# EAGLE design input-selector (EAGLE 7.7.0)

## Sheet 1 of 2
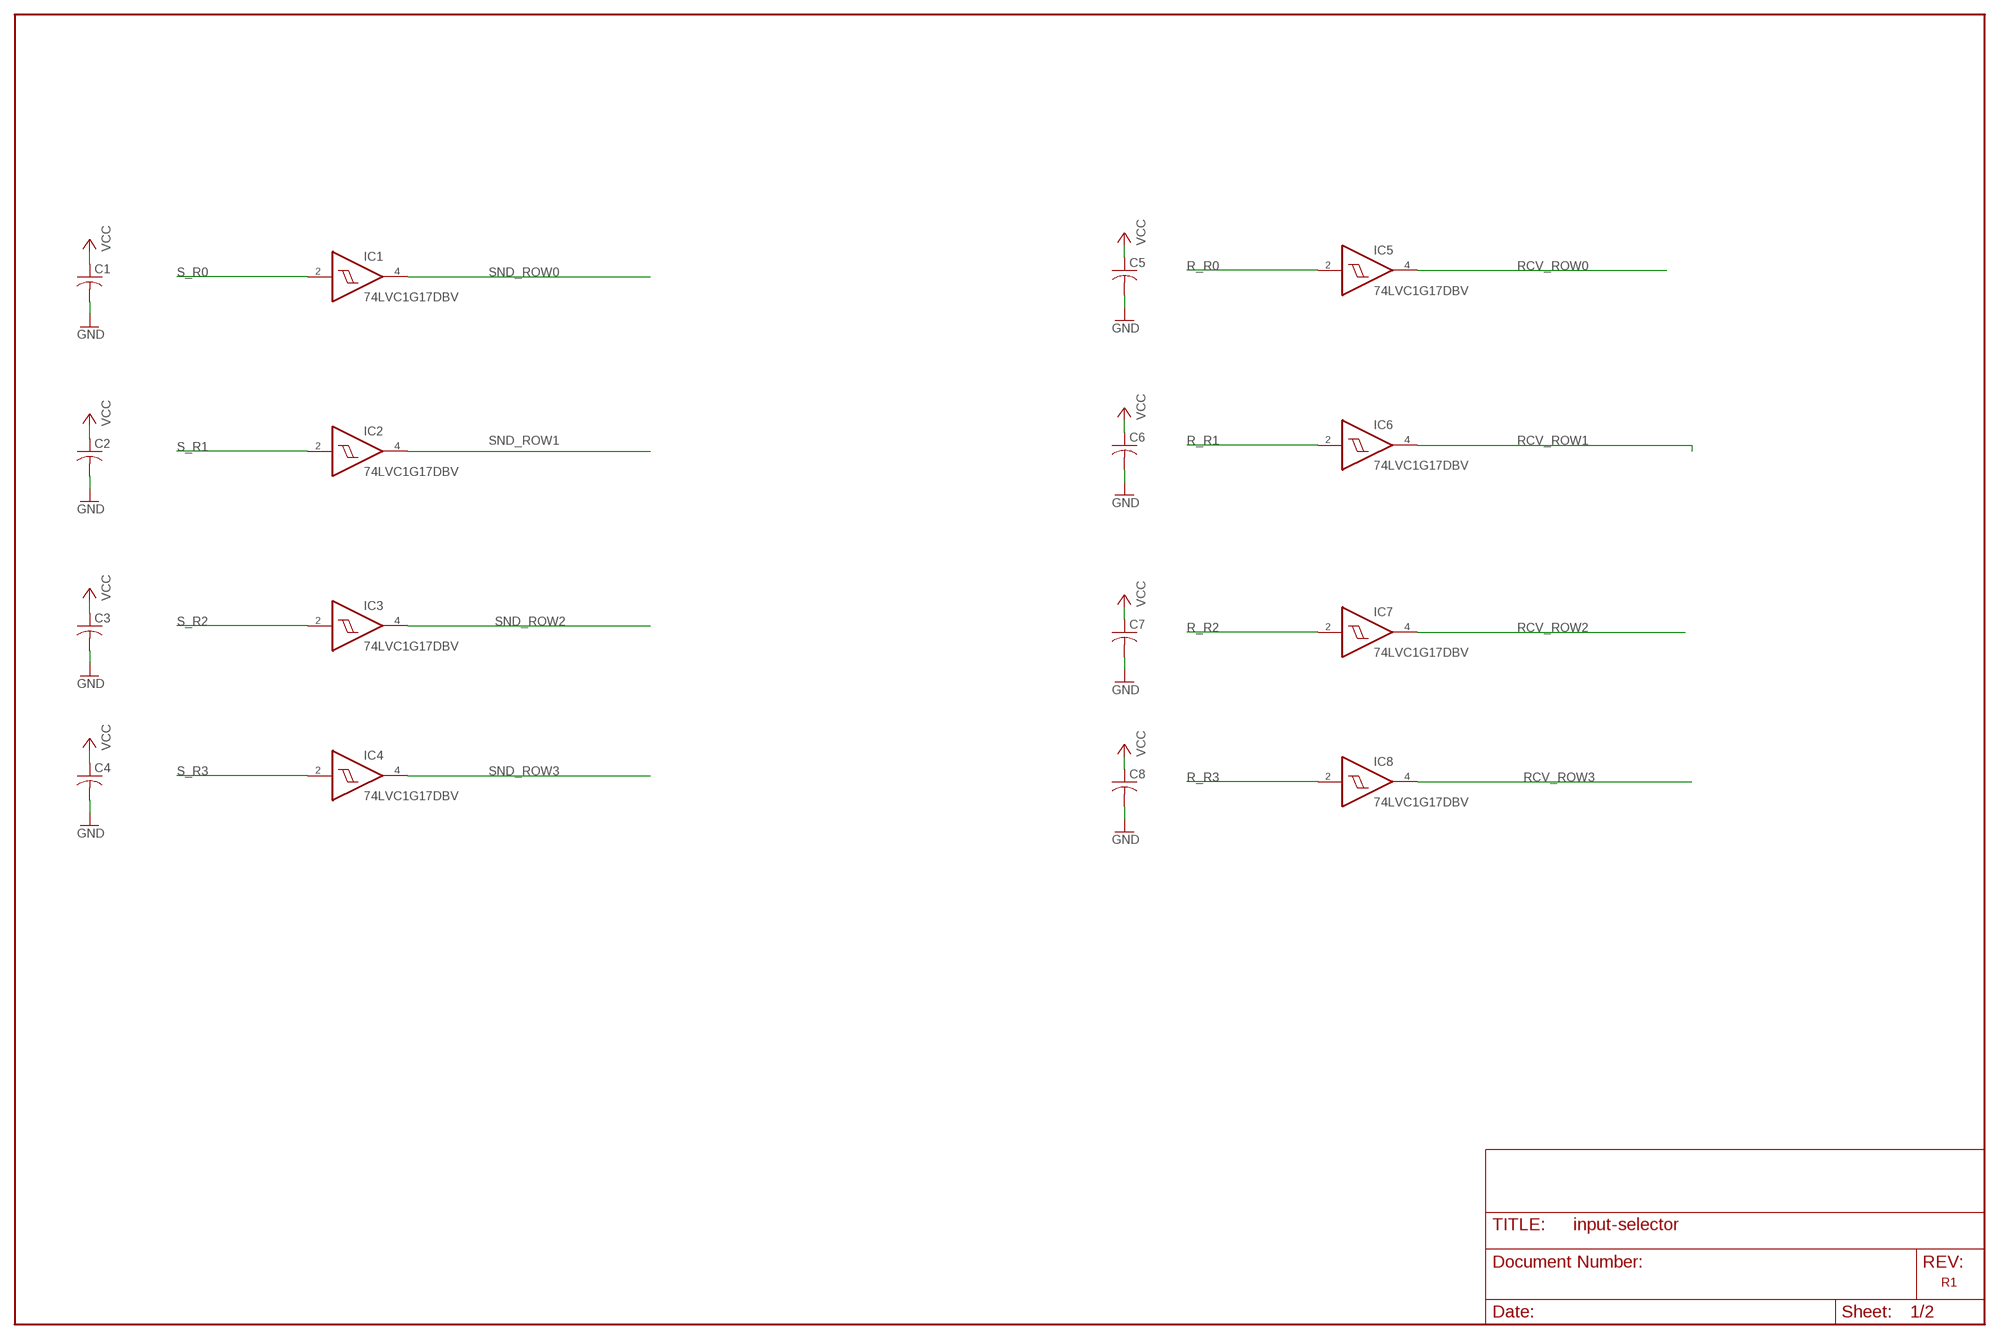
[diagram p0: schematic, sheet 1]

### Parts
C1  C-USC0603  [C0603]
C2  C-USC0603  [C0603]
C3  C-USC0603  [C0603]
C4  C-USC0603  [C0603]
C5  C-USC0603  [C0603]
C6  C-USC0603  [C0603]
C7  C-USC0603  [C0603]
C8  C-USC0603  [C0603]
IC1  74LVC1G17DBV  [SOT23-5]
IC2  74LVC1G17DBV  [SOT23-5]
IC3  74LVC1G17DBV  [SOT23-5]
IC4  74LVC1G17DBV  [SOT23-5]
IC5  74LVC1G17DBV  [SOT23-5]
IC6  74LVC1G17DBV  [SOT23-5]
IC7  74LVC1G17DBV  [SOT23-5]
IC8  74LVC1G17DBV  [SOT23-5]

### Nets
GND: C1.2 C2.2 C3.2 C4.2 C5.2 C6.2 C7.2 C8.2 ; also sheet 2
R_R0: IC5.2(I) ; also sheet 2
R_R1: IC6.2(I) ; also sheet 2
R_R2: IC7.2(I) ; also sheet 2
R_R3: IC8.2(I) ; also sheet 2
RCV_ROW0: IC5.4(O) ; also sheet 2
RCV_ROW1: IC6.4(O) ; also sheet 2
RCV_ROW2: IC7.4(O) ; also sheet 2
RCV_ROW3: IC8.4(O) ; also sheet 2
S_R0: IC1.2(I) ; also sheet 2
S_R1: IC2.2(I) ; also sheet 2
S_R2: IC3.2(I) ; also sheet 2
S_R3: IC4.2(I) ; also sheet 2
SND_ROW0: IC1.4(O) ; also sheet 2
SND_ROW1: IC2.4(O) ; also sheet 2
SND_ROW2: IC3.4(O) ; also sheet 2
SND_ROW3: IC4.4(O) ; also sheet 2
VCC: C1.1 C2.1 C3.1 C4.1 C5.1 C6.1 C7.1 C8.1 ; also sheet 2

### Notes on the sheet
- R1

## Sheet 2 of 2
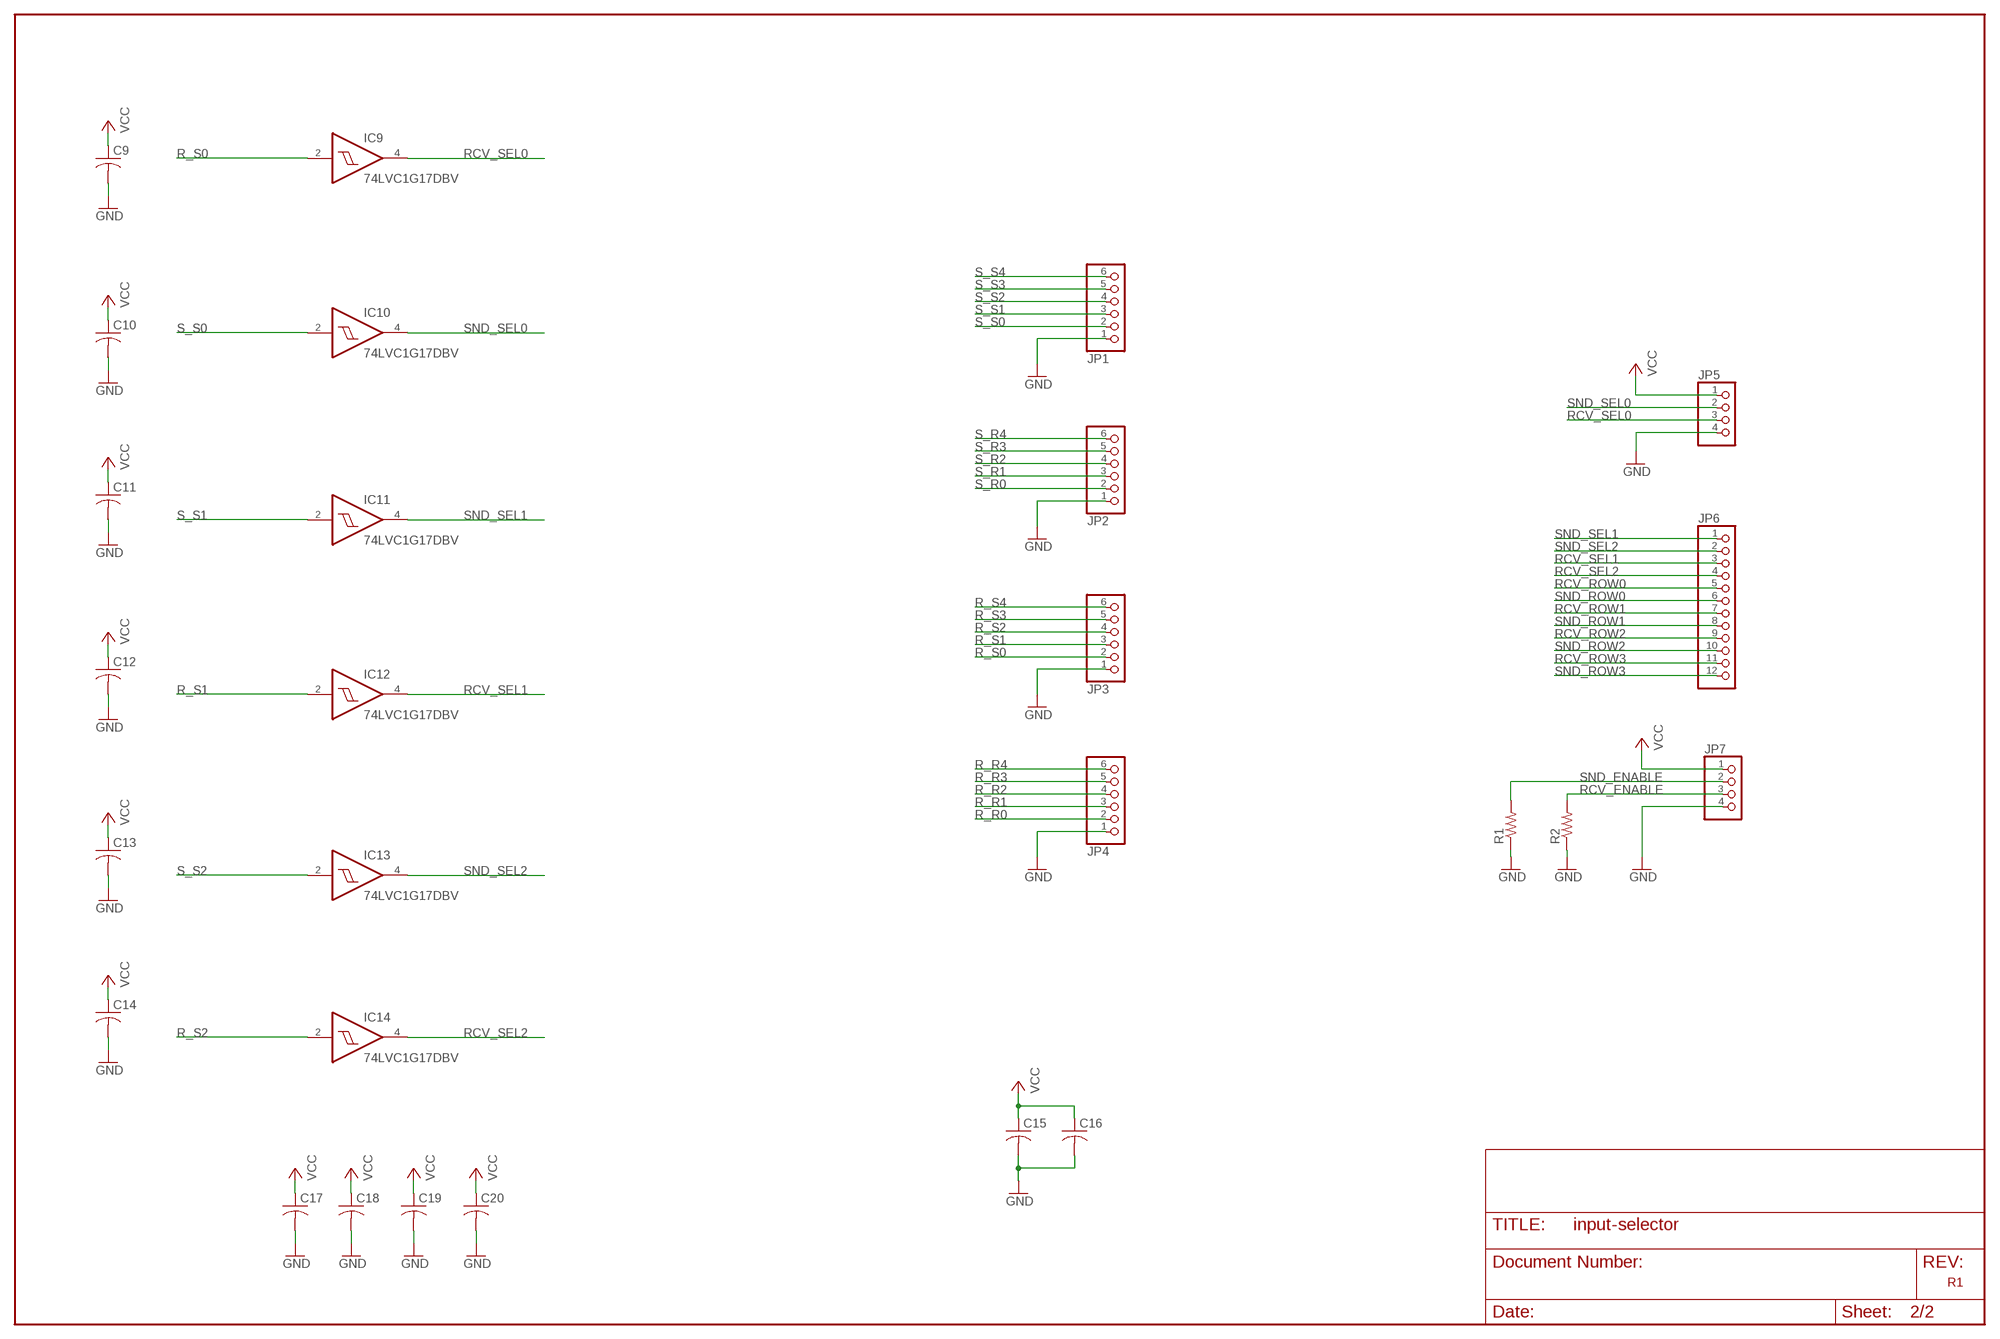
[diagram p1: schematic, sheet 2]

### Parts
C9  C-USC0603  [C0603]
C10  C-USC0603  [C0603]
C11  C-USC0603  [C0603]
C12  C-USC0603  [C0603]
C13  C-USC0603  [C0603]
C14  C-USC0603  [C0603]
C15  C-USC0805  [C0805]
C16  C-USC0805  [C0805]
C17  C-USC0603  [C0603]
C18  C-USC0603  [C0603]
C19  C-USC0603  [C0603]
C20  C-USC0603  [C0603]
IC9  74LVC1G17DBV  [SOT23-5]
IC10  74LVC1G17DBV  [SOT23-5]
IC11  74LVC1G17DBV  [SOT23-5]
IC12  74LVC1G17DBV  [SOT23-5]
IC13  74LVC1G17DBV  [SOT23-5]
IC14  74LVC1G17DBV  [SOT23-5]
JP1  PINHD-1X6  [1X06]
JP2  PINHD-1X6  [1X06]
JP3  PINHD-1X6  [1X06]
JP4  PINHD-1X6  [1X06]
JP5  PINHD-1X4  [1X04]
JP6  PINHD-1X12  [1X12]
JP7  PINHD-1X4  [1X04]
R1  R-US_R0805  [R0805]
R2  R-US_R0805  [R0805]

### Nets
GND: C9.2 C10.2 C11.2 C12.2 C13.2 C14.2 C15.2 C16.2 C17.2 C18.2 C19.2 C20.2 JP1.1 JP2.1 JP3.1 JP4.1 JP5.4 JP7.4 R1.1 R2.1 ; also sheet 1
R_R0: JP4.2 ; also sheet 1
R_R1: JP4.3 ; also sheet 1
R_R2: JP4.4 ; also sheet 1
R_R3: JP4.5 ; also sheet 1
R_R4: JP4.6
R_S0: IC9.2(I) JP3.2
R_S1: IC12.2(I) JP3.3
R_S2: IC14.2(I) JP3.4
R_S3: JP3.5
R_S4: JP3.6
RCV_ENABLE: JP7.3 R2.2
RCV_ROW0: JP6.5 ; also sheet 1
RCV_ROW1: JP6.7 ; also sheet 1
RCV_ROW2: JP6.9 ; also sheet 1
RCV_ROW3: JP6.11 ; also sheet 1
RCV_SEL0: IC9.4(O) JP5.3
RCV_SEL1: IC12.4(O) JP6.3
RCV_SEL2: IC14.4(O) JP6.4
S_R0: JP2.2 ; also sheet 1
S_R1: JP2.3 ; also sheet 1
S_R2: JP2.4 ; also sheet 1
S_R3: JP2.5 ; also sheet 1
S_R4: JP2.6
S_S0: IC10.2(I) JP1.2
S_S1: IC11.2(I) JP1.3
S_S2: IC13.2(I) JP1.4
S_S3: JP1.5
S_S4: JP1.6
SND_ENABLE: JP7.2 R1.2
SND_ROW0: JP6.6 ; also sheet 1
SND_ROW1: JP6.8 ; also sheet 1
SND_ROW2: JP6.10 ; also sheet 1
SND_ROW3: JP6.12 ; also sheet 1
SND_SEL0: IC10.4(O) JP5.2
SND_SEL1: IC11.4(O) JP6.1
SND_SEL2: IC13.4(O) JP6.2
VCC: C9.1 C10.1 C11.1 C12.1 C13.1 C14.1 C15.1 C16.1 C17.1 C18.1 C19.1 C20.1 JP5.1 JP7.1 ; also sheet 1

### Notes on the sheet
- R1

## Power pins joined to a net without a drawn wire
GND: IC1.3(GND) IC2.3(GND) IC3.3(GND) IC4.3(GND) IC5.3(GND) IC6.3(GND) IC7.3(GND) IC8.3(GND) IC9.3(GND) IC10.3(GND) IC11.3(GND) IC12.3(GND) IC13.3(GND) IC14.3(GND)
VCC: IC1.5(VCC) IC2.5(VCC) IC3.5(VCC) IC4.5(VCC) IC5.5(VCC) IC6.5(VCC) IC7.5(VCC) IC8.5(VCC) IC9.5(VCC) IC10.5(VCC) IC11.5(VCC) IC12.5(VCC) IC13.5(VCC) IC14.5(VCC)

## Library data of the parts
C1-C20 = resistor:C-US: CAPACITOR, American symbol
IC1-IC14 = 74xx-little-us:74*1G17: Single Schmitt-Trigger Buffer
JP1-JP4 = custom-pinhead:PINHD-1X6: PIN HEADER
JP5 JP7 = pinhead:PINHD-1X4: PIN HEADER
JP6 = custom-pinhead:PINHD-1X12: PIN HEADER
R1 R2 = resistor:R-US_: RESISTOR, American symbol

## Board
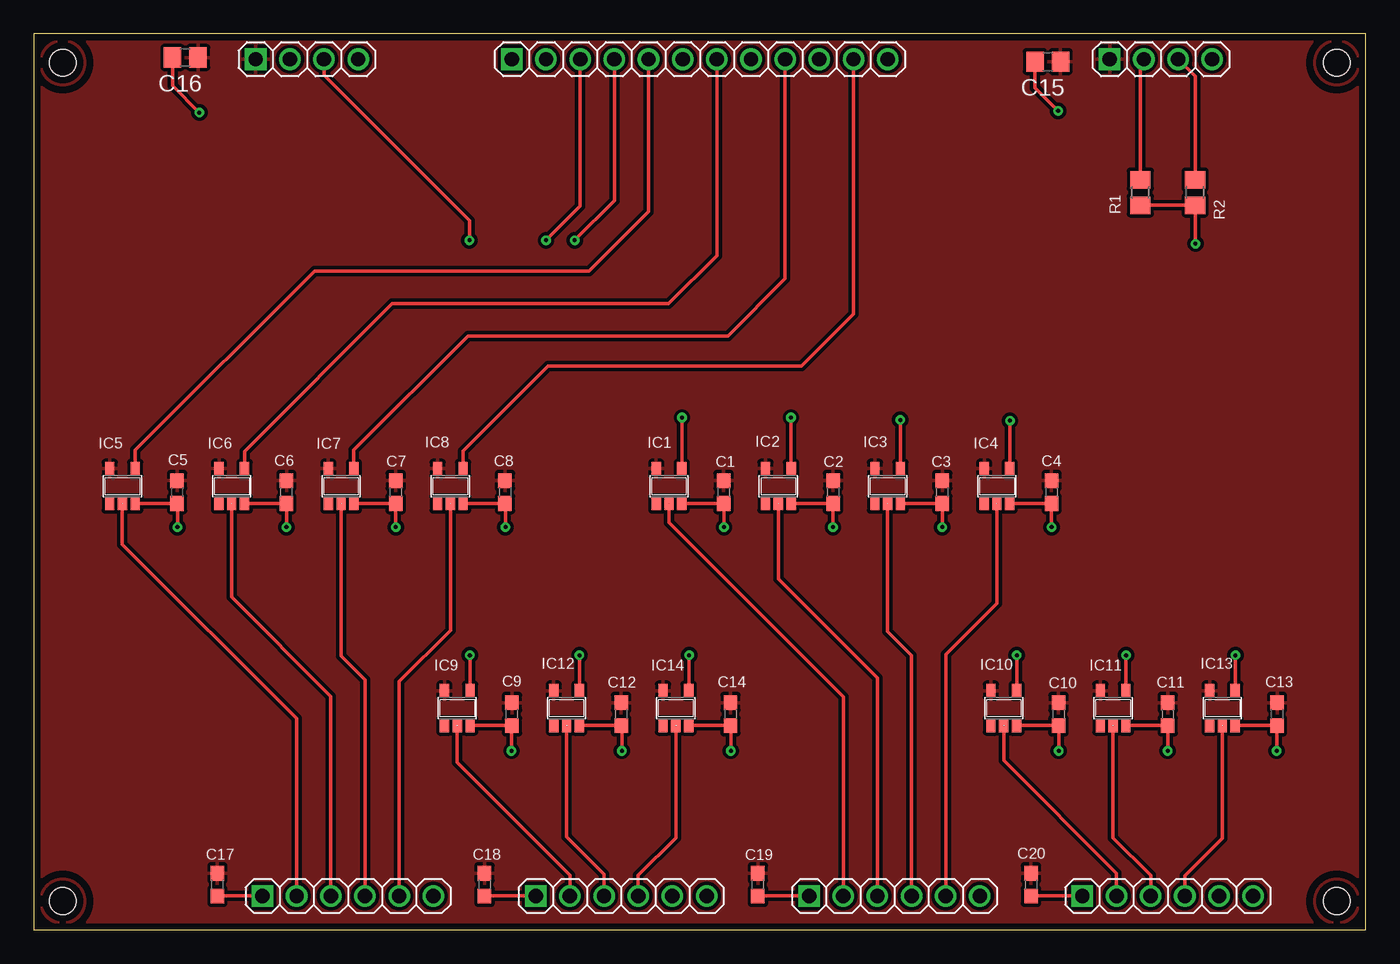
[diagram p2: board, top side]
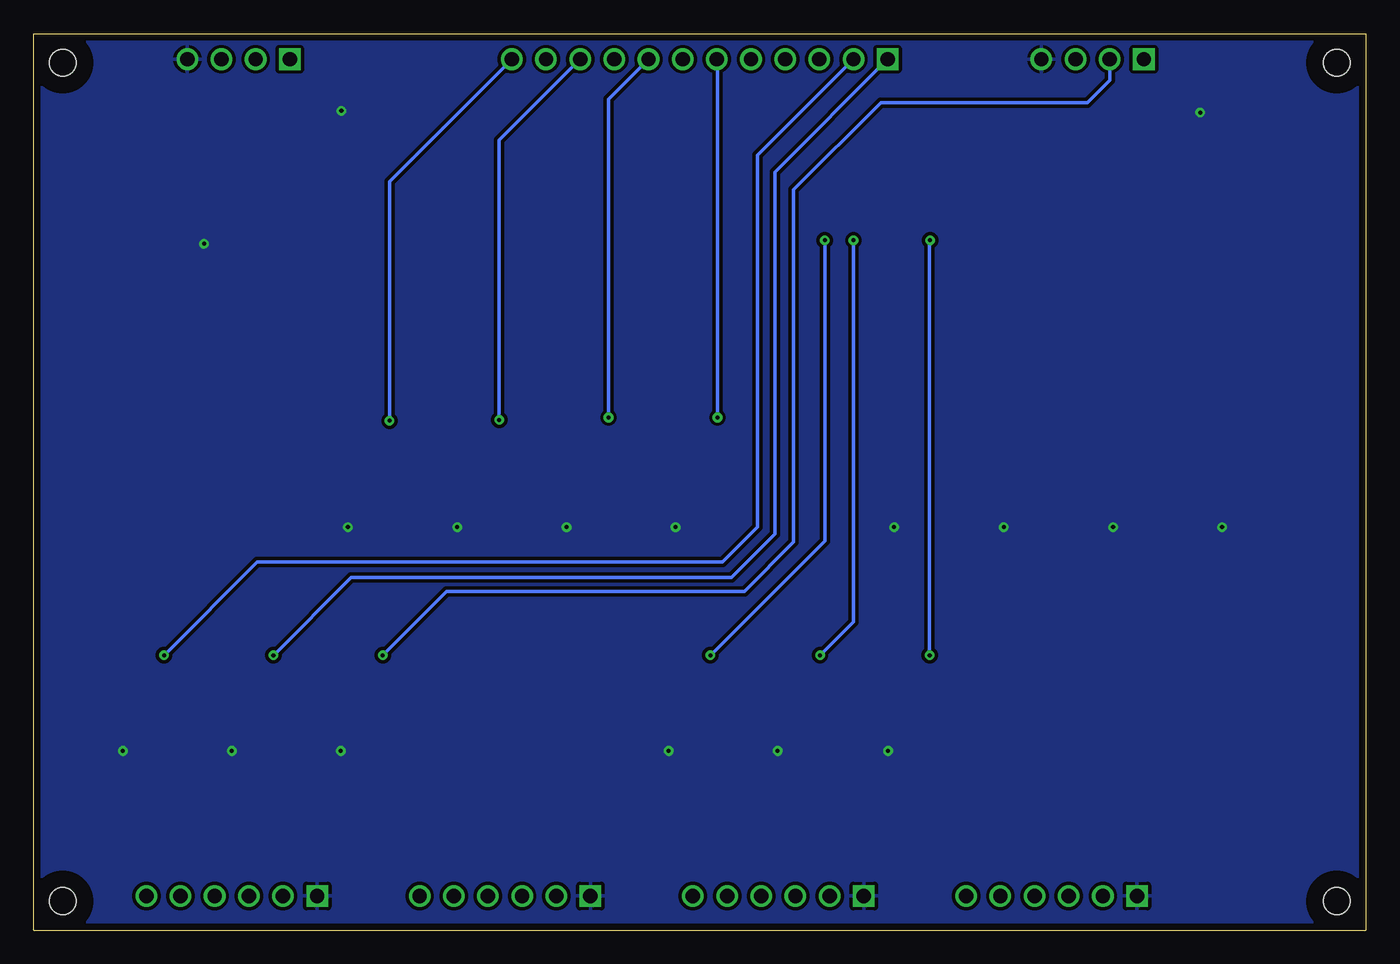
[diagram p3: board, bottom side, seen from below]

Size 99.06 x 66.67 mm. Coordinates in mm from the lower left corner, seen from the top.
Outline: 99.06,66.67 0,66.67 0,0 99.06,0 99.06,66.67
Copper layers (1*16): Top 0.035mm / dielectric 1.5mm / Bottom 0.035mm
Design rules "default *": minimum track width 8mil, minimum drill 12mil, track to track 8mil, track to pad 10mil, pad to pad 10mil, via to via 8mil, smd to smd 8mil, copper to edge 20mil, drill to drill 8mil, minimum pad ring 10mil, minimum via ring 8mil, stop-mask expansion 4mil, vias tented up to drill 0mil, thermal gap 10mil
Holes 2.01 mm at 2.16,2.16 96.9,2.16 96.9,64.52 2.16,64.52
tRestrict: area 94.9,0.2 to 98.9,4.2; area 94.9,62.5 to 98.9,66.5; area 0.2,62.5 to 4.2,66.5; area 0.2,0.2 to 4.2,4.2
bRestrict: area 94.9,0.2 to 98.9,4.2; area 94.9,62.5 to 98.9,66.5; area 0.2,62.5 to 4.2,66.5; area 0.2,0.2 to 4.2,4.2

### Footprints (pad centres in the part's own frame; a part is rotated, then mirrored left to right if it is on the bottom)
C0603 = smd 1.1 x 1: 1 -0.85,0; 2 0.85,0
C0805 = smd 1.3 x 1.5: 1 -0.95,0; 2 0.95,0
SOT23-5 = smd 0.69 x 0.99: 1 -0.95,-1.29; 2 0,-1.29; 3 0.95,-1.29; 4 0.95,1.3; 5 -0.95,1.3
1X06 = drill 1.067 square: 1 -6.35,0 | drill 1.067: 2 -3.81,0; 3 -1.27,0; 4 1.27,0; 5 3.81,0; 6 6.35,0
1X04 = drill 1.067 square: 1 -3.81,0 | drill 1.067: 2 -1.27,0; 3 1.27,0; 4 3.81,0
1X12 = drill 1.067 square: 1 -13.97,0 | drill 1.067: 2 -11.43,0; 3 -8.89,0; 4 -6.35,0; 5 -3.81,0; 6 -1.27,0; 7 1.27,0; 8 3.81,0; 9 6.35,0; 10 8.89,0; 11 11.43,0; 12 13.97,0
R0805 = smd 1.3 x 1.5: 1 -0.95,0; 2 0.95,0

### Placement (x,y rotation side)
C1  51.31,32.58 270 top
C2  59.44,32.58 270 top
C3  67.56,32.58 270 top
C4  75.69,32.58 270 top
C5  10.67,32.58 270 top
C6  18.8,32.58 270 top
C7  26.92,32.58 270 top
C8  35.05,32.58 270 top
C9  35.56,16.07 270 top
C10  76.2,16.07 270 top
C11  84.33,16.07 270 top
C12  43.69,16.07 270 top
C13  92.46,16.07 270 top
C14  51.82,16.07 270 top
C15  75.41,64.59 180 top
C16  11.28,64.9 180 top
C17  13.67,3.39 270 top
C18  33.53,3.39 270 top
C19  53.85,3.39 270 top
C20  74.17,3.39 270 top
IC1  47.24,33.02 0 top
IC2  55.37,33.02 0 top
IC3  63.5,33.02 0 top
IC4  71.63,33.02 0 top
IC5  6.6,33.02 0 top
IC6  14.73,33.02 0 top
IC7  22.86,33.02 0 top
IC8  30.99,33.02 0 top
IC9  31.5,16.51 0 top
IC10  72.14,16.51 0 top
IC11  80.26,16.51 0 top
IC12  39.62,16.51 0 top
IC13  88.39,16.51 0 top
IC14  47.75,16.51 0 top
JP1  84.33,2.54 0 top
JP2  64.01,2.54 0 top
JP3  43.69,2.54 0 top
JP4  23.37,2.54 0 top
JP5  20.32,64.77 0 top
JP6  49.53,64.77 0 top
JP7  83.82,64.77 0 top
R1  82.3,54.86 90 top
R2  86.36,54.86 90 top

### Tracks (layer width: path | path; a pad name or v marks a point on that pad's centre or on a via)
GND  (via drill 0.3)
  Top 0.254: IC10.3 C10.2 76.22,15.19 v76.22,13.34 | IC11.3 C11.2 v84.33,13.34 | IC13.3 C13.2 92.43,15.19 v92.43,13.34 | IC9.3 C9.2 35.53,15.19 v35.53,13.34 | IC12.3 C12.2 43.74,15.16 v43.74,13.34 | IC14.3 C14.2 51.84,15.19 v51.84,13.34 | IC1.3 C1.2 51.33,31.7 v51.33,29.97 | IC2.3 C2.2 v59.44,29.97 | IC3.3 C3.2 v67.56,29.97 | IC4.3 C4.2 v75.69,29.97 | IC5.3 C5.2 10.69,31.7 v10.69,29.97 | IC6.3 C6.2 v18.8,29.97 | IC7.3 C7.2 v26.92,29.97 | IC8.3 C8.2 35.08,31.7 v35.08,29.97 | R1.1 R2.1 86.39,53.89 v86.39,51.05 | C16.2 10.33,62.8 v12.32,60.81 | C15.2 74.46,62.65 v76.17,60.94 | JP4.1 C17.2 | JP3.1 C18.2 | JP2.1 C19.2 | JP1.1 C20.2
  pour Bottom (isolate 0.254): 99.06,0 0,0 0,66.67 99.06,66.67
R_R0
  Top 0.254: IC5.2 6.6,28.7 19.56,15.75 JP4.2
R_R1
  Top 0.254: IC6.2 14.73,24.77 22.1,17.4 JP4.3
R_R2
  Top 0.254: IC7.2 22.86,20.4 24.64,18.62 JP4.4
R_R3
  Top 0.254: IC8.2 30.99,22.3 27.18,18.49 JP4.5
R_S0
  Top 0.254: IC9.2 31.5,12.47 39.88,4.09 JP3.2
R_S1
  Top 0.254: IC12.2 39.62,6.93 42.42,4.14 JP3.3
R_S2
  Top 0.254: IC14.2 47.75,6.88 44.96,4.09 JP3.4
RCV_ENABLE
  Top 0.254: R2.2 86.36,63.5 JP7.3
RCV_ROW0
  Top 0.254: IC5.4 7.55,35.7 20.88,49.02 41.3,49.02 45.72,53.44 JP6.5
RCV_ROW1
  Top 0.254: IC6.4 15.68,35.6 26.67,46.58 47.22,46.58 50.8,50.16 JP6.7
RCV_ROW2
  Top 0.254: IC7.4 23.81,35.7 32.31,44.2 51.64,44.2 55.88,48.44 JP6.9
RCV_ROW3
  Top 0.254: IC8.4 31.94,35.65 38.25,41.96 57.1,41.96 60.96,45.82 JP6.11
RCV_SEL0  (via drill 0.3)
  Top 0.254: JP5.3 21.59,63.58 32.41,52.76 v32.41,51.31 | v32.44,20.45 32.44,17.81 IC9.4
  Bottom 0.254: v32.41,51.31 32.44,51.26 v32.44,20.45
RCV_SEL1  (via drill 0.3)
  Top 0.254: v40.59,20.45 40.59,17.82 IC12.4 | JP6.3 40.64,53.85 v38.1,51.31
  Bottom 0.254: v38.1,51.31 38.1,22.94 v40.59,20.45
RCV_SEL2  (via drill 0.3)
  Top 0.254: v48.74,20.45 48.74,17.85 IC14.4 | JP6.4 43.18,54.25 v40.23,51.31
  Bottom 0.254: v40.23,51.31 40.23,28.96 v48.74,20.45
S_R0
  Top 0.254: IC1.2 47.24,30.3 60.2,17.35 JP2.2
S_R1
  Top 0.254: IC2.2 55.37,26.14 62.74,18.77 JP2.3
S_R2
  Top 0.254: IC3.2 63.5,22.23 65.28,20.45 JP2.4
S_R3
  Top 0.254: IC4.2 71.63,24.31 67.82,20.5 JP2.5
S_S0
  Top 0.254: IC10.2 72.14,12.62 80.52,4.24 JP1.2
S_S1
  Top 0.254: IC11.2 80.26,6.88 83.06,4.09 JP1.3
S_S2
  Top 0.254: IC13.2 88.39,6.83 85.6,4.04 JP1.4
SND_ENABLE
  Top 0.254: R1.2 82.3,64.52 JP7.2
SND_ROW0  (via drill 0.3)
  Top 0.254: v48.21,38.12 arc90 48.19,38.11 IC1.4
  Bottom 0.254: JP6.6 48.21,64.72 v48.21,38.12
SND_ROW1  (via drill 0.3)
  Top 0.254: v56.31,38.12 56.32,38.12 IC2.4
  Bottom 0.254: JP6.8 56.31,61.8 v56.31,38.12
SND_ROW2  (via drill 0.3)
  Top 0.254: v64.44,37.95 IC3.4
  Bottom 0.254: JP6.10 64.44,58.75 v64.44,37.95
SND_ROW3  (via drill 0.3)
  Top 0.254: v72.59,37.9 72.59,34.34 arc-90 IC4.4
  Bottom 0.254: JP6.12 72.59,55.68 v72.59,37.9
SND_SEL0  (via drill 0.3)
  Top 0.254: v73.1,20.45 73.1,17.82 IC10.4
  Bottom 0.254: JP5.2 19.05,63.2 20.7,61.54 36.07,61.54 42.55,55.07 42.55,28.85 46.2,25.2 68.35,25.2 v73.1,20.45
SND_SEL1  (via drill 0.3)
  Top 0.254: v81.23,20.45 81.23,17.82 IC11.4
  Bottom 0.254: JP6.1 43.94,56.39 43.94,29.46 47.17,26.24 75.44,26.24 v81.23,20.45
SND_SEL2  (via drill 0.3)
  Top 0.254: v89.36,20.45 89.36,17.82 IC13.4
  Bottom 0.254: JP6.2 45.24,57.63 45.24,29.97 47.83,27.38 82.42,27.38 v89.36,20.45
VCC
  pour Top (isolate 0.254, rank 2): 99.06,0 0,0 0,66.67 99.06,66.67

### Text on the board
Document: Block 0 | Block 1 and 2 | SND/RCV / ENABLE | Input Selector Interconnect | RCV ROW | RCV STORE | SND ROW | SND STORE